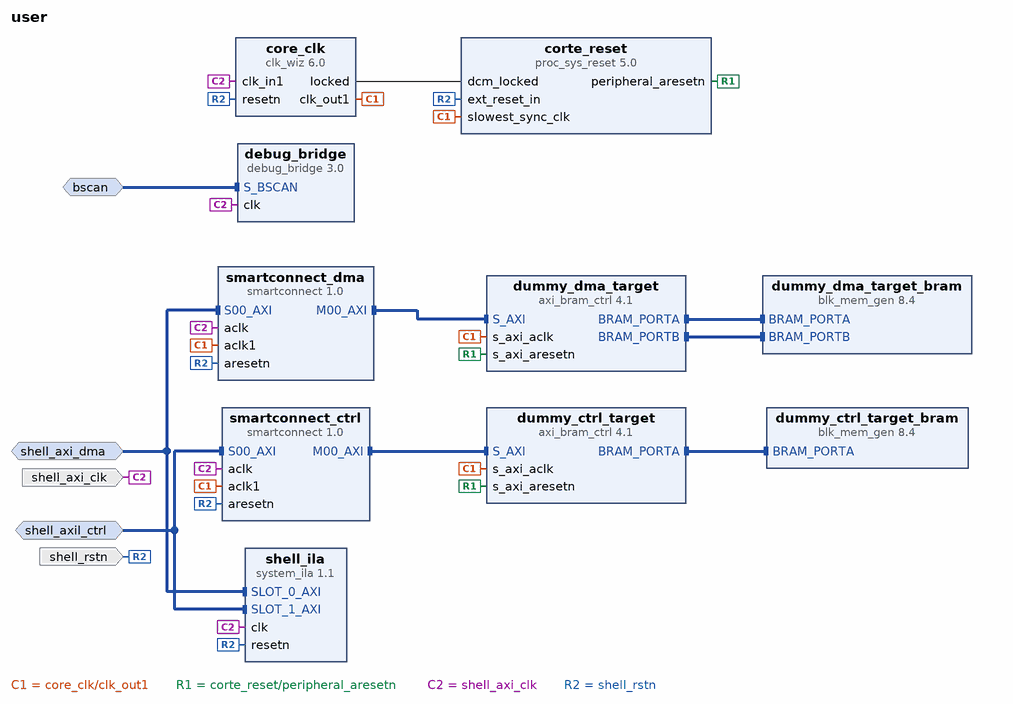
[diagram p0: block diagram of the top level]
# Vivado block design user, xcu250-figd2104-2L-e, Vivado 2023.1
create_bd_design user

create_bd_intf_port -mode Slave -vlnv xilinx.com:interface:bscan_rtl:1.0 bscan
create_bd_intf_port -mode Slave -vlnv xilinx.com:interface:aximm_rtl:1.0 shell_axil_ctrl
set_property -dict [list \
  CONFIG.ADDR_WIDTH 32 \
  CONFIG.ARUSER_WIDTH 0 \
  CONFIG.AWUSER_WIDTH 0 \
  CONFIG.BUSER_WIDTH 0 \
  CONFIG.DATA_WIDTH 32 \
  CONFIG.FREQ_HZ 250000000 \
  CONFIG.HAS_BRESP 1 \
  CONFIG.HAS_BURST 0 \
  CONFIG.HAS_CACHE 0 \
  CONFIG.HAS_LOCK 0 \
  CONFIG.HAS_PROT 1 \
  CONFIG.HAS_QOS 0 \
  CONFIG.HAS_REGION 0 \
  CONFIG.HAS_RRESP 1 \
  CONFIG.HAS_WSTRB 1 \
  CONFIG.ID_WIDTH 0 \
  CONFIG.MAX_BURST_LENGTH 1 \
  CONFIG.NUM_READ_OUTSTANDING 1 \
  CONFIG.NUM_READ_THREADS 1 \
  CONFIG.NUM_WRITE_OUTSTANDING 1 \
  CONFIG.NUM_WRITE_THREADS 1 \
  CONFIG.PROTOCOL AXI4LITE \
  CONFIG.READ_WRITE_MODE READ_WRITE \
  CONFIG.RUSER_BITS_PER_BYTE 0 \
  CONFIG.RUSER_WIDTH 0 \
  CONFIG.SUPPORTS_NARROW_BURST 0 \
  CONFIG.WUSER_BITS_PER_BYTE 0 \
  CONFIG.WUSER_WIDTH 0 \
  CONFIG.master_id 1 \
] [get_bd_intf_ports shell_axil_ctrl]
create_bd_intf_port -mode Slave -vlnv xilinx.com:interface:aximm_rtl:1.0 shell_axi_dma
set_property -dict [list \
  CONFIG.ADDR_WIDTH 64 \
  CONFIG.ARUSER_WIDTH 0 \
  CONFIG.AWUSER_WIDTH 0 \
  CONFIG.BUSER_WIDTH 0 \
  CONFIG.DATA_WIDTH 256 \
  CONFIG.FREQ_HZ 250000000 \
  CONFIG.HAS_BRESP 1 \
  CONFIG.HAS_BURST 1 \
  CONFIG.HAS_CACHE 1 \
  CONFIG.HAS_LOCK 1 \
  CONFIG.HAS_PROT 1 \
  CONFIG.HAS_QOS 1 \
  CONFIG.HAS_REGION 0 \
  CONFIG.HAS_RRESP 1 \
  CONFIG.HAS_WSTRB 1 \
  CONFIG.ID_WIDTH 4 \
  CONFIG.MAX_BURST_LENGTH 256 \
  CONFIG.NUM_READ_OUTSTANDING 32 \
  CONFIG.NUM_READ_THREADS 1 \
  CONFIG.NUM_WRITE_OUTSTANDING 16 \
  CONFIG.NUM_WRITE_THREADS 1 \
  CONFIG.PROTOCOL AXI4 \
  CONFIG.READ_WRITE_MODE READ_WRITE \
  CONFIG.RUSER_BITS_PER_BYTE 0 \
  CONFIG.RUSER_WIDTH 0 \
  CONFIG.SUPPORTS_NARROW_BURST 0 \
  CONFIG.WUSER_BITS_PER_BYTE 0 \
  CONFIG.WUSER_WIDTH 0 \
  CONFIG.master_id 1 \
] [get_bd_intf_ports shell_axi_dma]
create_bd_port -dir I -type clk shell_axi_clk
set_property -dict [list \
  CONFIG.ASSOCIATED_BUSIF shell_axil_ctrl:shell_axi_dma \
  CONFIG.ASSOCIATED_RESET shell_rstn \
  CONFIG.FREQ_HZ 250000000 \
] [get_bd_ports shell_axi_clk]
create_bd_port -dir I -type rst shell_rstn

create_bd_cell -type ip -vlnv xilinx.com:ip:debug_bridge:3.0 debug_bridge
set_property -dict {CONFIG.C_DESIGN_TYPE 1} [get_bd_cells debug_bridge]
create_bd_cell -type ip -vlnv xilinx.com:ip:axi_bram_ctrl:4.1 dummy_ctrl_target
set_property -dict {CONFIG.PROTOCOL AXI4LITE CONFIG.SINGLE_PORT_BRAM 1} [get_bd_cells dummy_ctrl_target]
create_bd_cell -type ip -vlnv xilinx.com:ip:smartconnect:1.0 smartconnect_ctrl
set_property -dict {CONFIG.NUM_CLKS 2 CONFIG.NUM_SI 1} [get_bd_cells smartconnect_ctrl]
create_bd_cell -type ip -vlnv xilinx.com:ip:blk_mem_gen:8.4 dummy_ctrl_target_bram
create_bd_cell -type ip -vlnv xilinx.com:ip:axi_bram_ctrl:4.1 dummy_dma_target
set_property -dict {CONFIG.DATA_WIDTH 256 CONFIG.SINGLE_PORT_BRAM 0} [get_bd_cells dummy_dma_target]
create_bd_cell -type ip -vlnv xilinx.com:ip:blk_mem_gen:8.4 dummy_dma_target_bram
set_property -dict {CONFIG.Memory_Type True_Dual_Port_RAM CONFIG.PRIM_type_to_Implement URAM} [get_bd_cells dummy_dma_target_bram]
create_bd_cell -type ip -vlnv xilinx.com:ip:smartconnect:1.0 smartconnect_dma
set_property -dict {CONFIG.NUM_CLKS 2 CONFIG.NUM_SI 1} [get_bd_cells smartconnect_dma]
create_bd_cell -type ip -vlnv xilinx.com:ip:system_ila:1.1 shell_ila
set_property -dict {CONFIG.C_NUM_MONITOR_SLOTS 2} [get_bd_cells shell_ila]
create_bd_cell -type ip -vlnv xilinx.com:ip:clk_wiz:6.0 core_clk
set_property -dict [list \
  CONFIG.CLKOUT1_JITTER 85.152 \
  CONFIG.CLKOUT1_PHASE_ERROR 78.266 \
  CONFIG.CLKOUT1_REQUESTED_OUT_FREQ 250 \
  CONFIG.MMCM_CLKFBOUT_MULT_F 4.750 \
  CONFIG.MMCM_CLKOUT0_DIVIDE_F 4.750 \
  CONFIG.RESET_PORT resetn \
  CONFIG.RESET_TYPE ACTIVE_LOW \
] [get_bd_cells core_clk]
create_bd_cell -type ip -vlnv xilinx.com:ip:proc_sys_reset:5.0 corte_reset

# ---- connections ----

connect_bd_intf_net -intf_net S_BSCAN_0_1 [get_bd_intf_ports bscan] [get_bd_intf_pins debug_bridge/S_BSCAN]
connect_bd_intf_net -intf_net dummy_ctrl_BRAM_PORTA [get_bd_intf_pins dummy_ctrl_target_bram/BRAM_PORTA] [get_bd_intf_pins dummy_ctrl_target/BRAM_PORTA]
connect_bd_intf_net [get_bd_intf_pins dummy_dma_target_bram/BRAM_PORTA] [get_bd_intf_pins dummy_dma_target/BRAM_PORTA]
connect_bd_intf_net [get_bd_intf_pins dummy_dma_target_bram/BRAM_PORTB] [get_bd_intf_pins dummy_dma_target/BRAM_PORTB]
connect_bd_intf_net [get_bd_intf_ports shell_axi_dma] [get_bd_intf_pins smartconnect_dma/S00_AXI]
connect_bd_intf_net [get_bd_intf_ports shell_axi_dma] [get_bd_intf_pins shell_ila/SLOT_0_AXI]
connect_bd_intf_net [get_bd_intf_ports shell_axil_ctrl] [get_bd_intf_pins smartconnect_ctrl/S00_AXI]
connect_bd_intf_net [get_bd_intf_ports shell_axil_ctrl] [get_bd_intf_pins shell_ila/SLOT_1_AXI]
connect_bd_intf_net [get_bd_intf_pins smartconnect_ctrl/M00_AXI] [get_bd_intf_pins dummy_ctrl_target/S_AXI]
connect_bd_intf_net [get_bd_intf_pins smartconnect_dma/M00_AXI] [get_bd_intf_pins dummy_dma_target/S_AXI]
connect_bd_net [get_bd_pins core_clk/clk_out1] \
  [get_bd_pins corte_reset/slowest_sync_clk] [get_bd_pins smartconnect_dma/aclk1] [get_bd_pins smartconnect_ctrl/aclk1] \
  [get_bd_pins dummy_dma_target/s_axi_aclk] [get_bd_pins dummy_ctrl_target/s_axi_aclk]
connect_bd_net [get_bd_pins core_clk/locked] [get_bd_pins corte_reset/dcm_locked]
connect_bd_net [get_bd_pins corte_reset/peripheral_aresetn] [get_bd_pins dummy_ctrl_target/s_axi_aresetn] [get_bd_pins dummy_dma_target/s_axi_aresetn]
connect_bd_net [get_bd_ports shell_axi_clk] \
  [get_bd_pins debug_bridge/clk] [get_bd_pins smartconnect_ctrl/aclk] [get_bd_pins smartconnect_dma/aclk] \
  [get_bd_pins shell_ila/clk] [get_bd_pins core_clk/clk_in1]
connect_bd_net [get_bd_ports shell_rstn] \
  [get_bd_pins smartconnect_ctrl/aresetn] [get_bd_pins smartconnect_dma/aresetn] [get_bd_pins shell_ila/resetn] \
  [get_bd_pins core_clk/resetn] [get_bd_pins corte_reset/ext_reset_in]

# ---- address map ----
assign_bd_address -offset 0x0000000000000000 -range 8K -target_address_space [get_bd_addr_spaces shell_axi_dma] [get_bd_addr_segs dummy_dma_target/S_AXI/Mem0]
assign_bd_address -offset 0x00000000 -range 8K -target_address_space [get_bd_addr_spaces shell_axil_ctrl] [get_bd_addr_segs dummy_ctrl_target/S_AXI/Mem0]

validate_bd_design
save_bd_design
